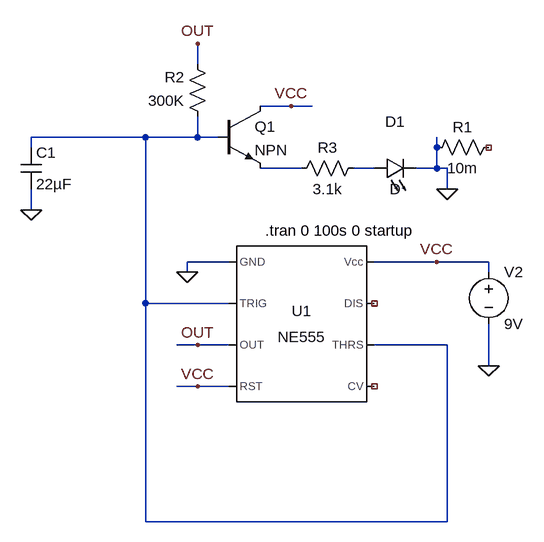
[diagram p0: schematic OnWayToWorking.asc]
OnWayToWorking.asc, the LTspice schematic file:
Version 4
SHEET 1 880 680
WIRE 64 -224 64 -256
WIRE 208 -160 160 -160
WIRE 240 -160 208 -160
WIRE -16 -112 -192 -112
WIRE 64 -112 64 -144
WIRE 64 -112 -16 -112
WIRE 96 -112 64 -112
WIRE -192 -96 -192 -112
WIRE 432 -96 432 -112
WIRE 224 -64 160 -64
WIRE 336 -64 304 -64
WIRE 432 -64 432 -96
WIRE 432 -64 400 -64
WIRE 448 -64 432 -64
WIRE 448 -32 448 -64
WIRE -192 0 -192 -32
WIRE 112 80 48 80
WIRE 432 80 336 80
WIRE 512 80 432 80
WIRE 48 96 48 80
WIRE 512 96 512 80
WIRE -16 144 -16 -112
WIRE 112 144 -16 144
WIRE 64 208 32 208
WIRE 112 208 64 208
WIRE 448 208 336 208
WIRE 512 240 512 176
WIRE 64 272 32 272
WIRE 112 272 64 272
WIRE -16 480 -16 144
WIRE 448 480 448 208
WIRE 448 480 -16 480
FLAG 48 96 0
FLAG 512 240 0
FLAG 432 80 VCC
FLAG 64 272 VCC
FLAG -192 0 0
FLAG 64 208 OUT
FLAG 64 -256 OUT
FLAG 208 -160 VCC
FLAG 448 -32 0
SYMBOL Misc\\NE555 224 176 R0
SYMATTR InstName U1
SYMBOL LED 336 -48 R270
WINDOW 0 72 32 VTop 2
WINDOW 3 0 32 VBottom 2
SYMATTR InstName D1
SYMBOL res 320 -80 R90
WINDOW 0 0 56 VBottom 2
WINDOW 3 32 56 VTop 2
SYMATTR InstName R3
SYMATTR Value 3.1k
SYMBOL npn 96 -160 R0
SYMATTR InstName Q1
SYMBOL voltage 512 80 R0
SYMATTR InstName V2
SYMATTR Value 9V
SYMBOL res 80 -128 R180
WINDOW 0 36 76 Left 2
WINDOW 3 36 40 Left 2
SYMATTR InstName R2
SYMATTR Value 300K
SYMBOL cap -208 -96 R0
SYMATTR InstName C1
SYMATTR Value 22µF
SYMBOL res 528 -112 R90
WINDOW 0 0 56 VBottom 2
WINDOW 3 32 56 VTop 2
SYMATTR InstName R1
SYMATTR Value 10m
TEXT 168 32 Left 2 !.tran 0 100s 0 startup

The netlist it stands for:
* OnWayToWorking.asc
XU1 0 N001 OUT VCC NC_01 N001 NC_02 VCC NE555  ; pins GND TRIG OUT RST CV THRS DIS Vcc
D1 N003 0 D
R3 N003 N002 3.1k
Q1 VCC N001 N002 0 NPN
V2 VCC 0 9V
R2 N001 OUT 300K
C1 N001 0 22µF
R1 NC_03 0 10m
.model D D
.lib standard.dio
.model NPN NPN
.model PNP PNP
.lib standard.bjt
.tran 0 100s 0 startup
.lib NE555.sub
.backanno
.end